# EasyEDA schematic tcc-esquemaico-aplicacoes.json

## Sheets
1 balanca-tcc: TITLE: Sheet_2; REV: 1.0; Date: 2021-08-01; Sheet: 1/1; Drawn By: victor-98; Company: Your Company
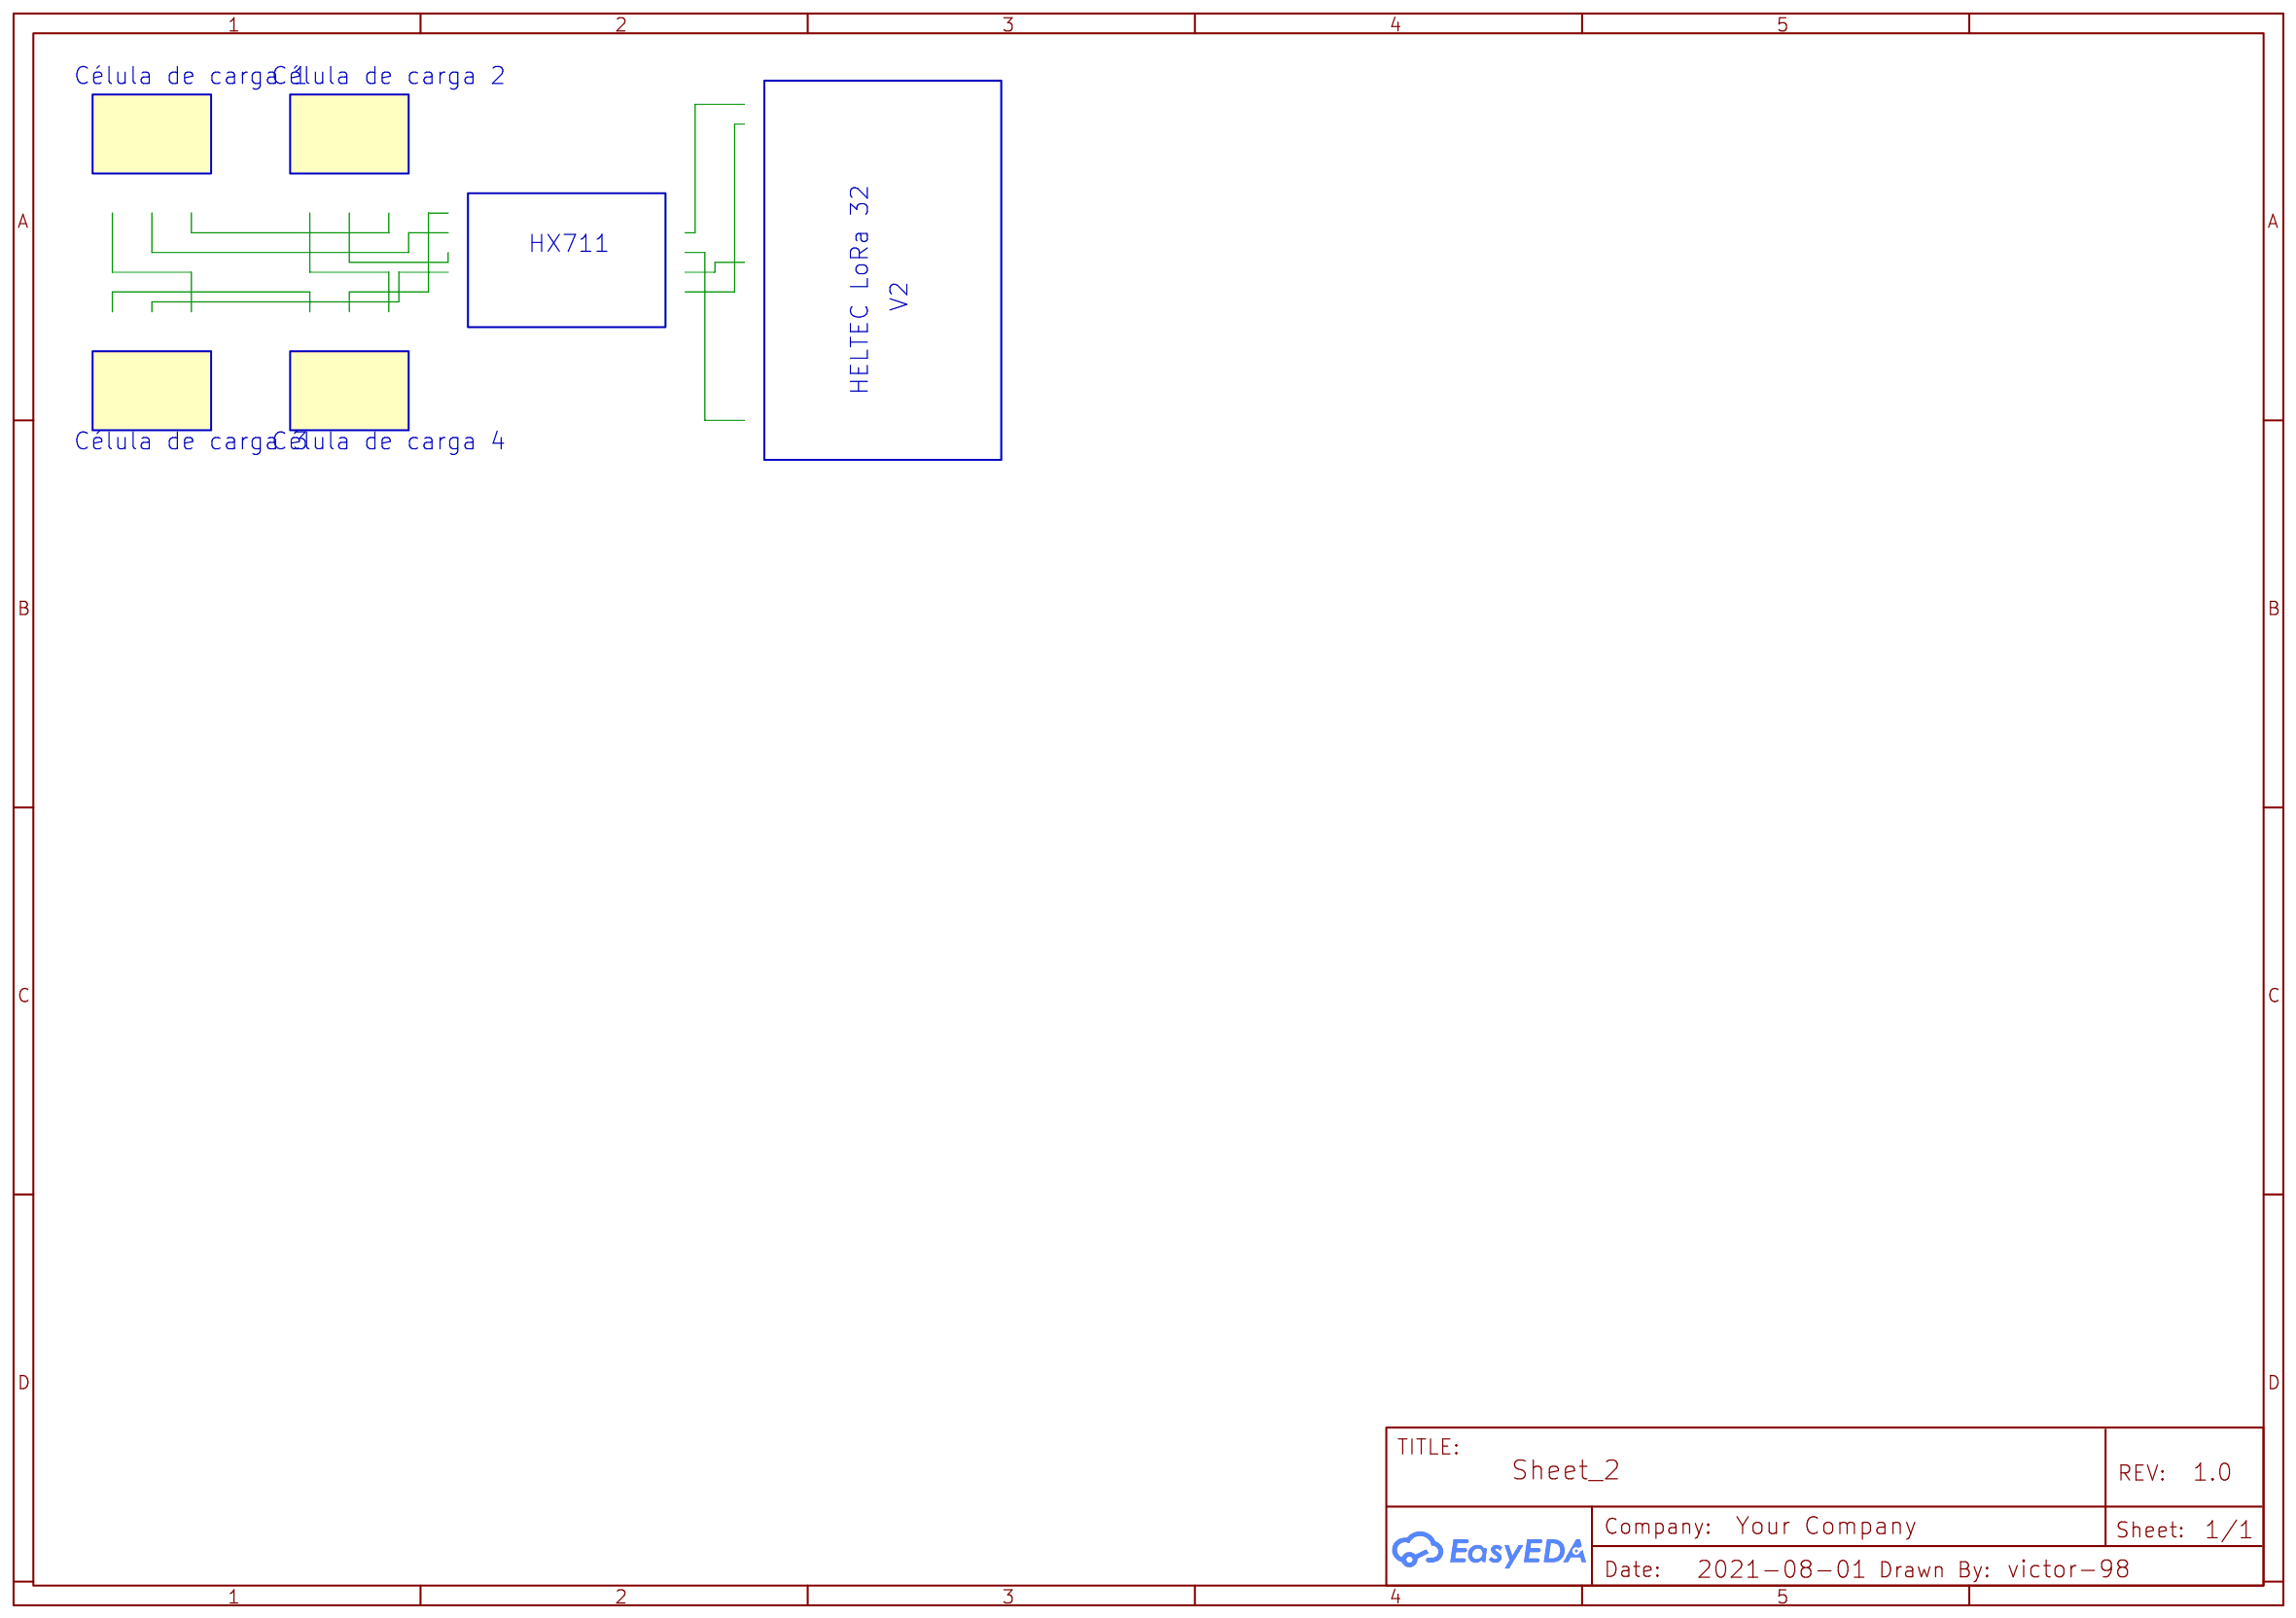
[diagram p0: balanca-tcc]
2 nivel-agua-tcc: TITLE: Sheet_1
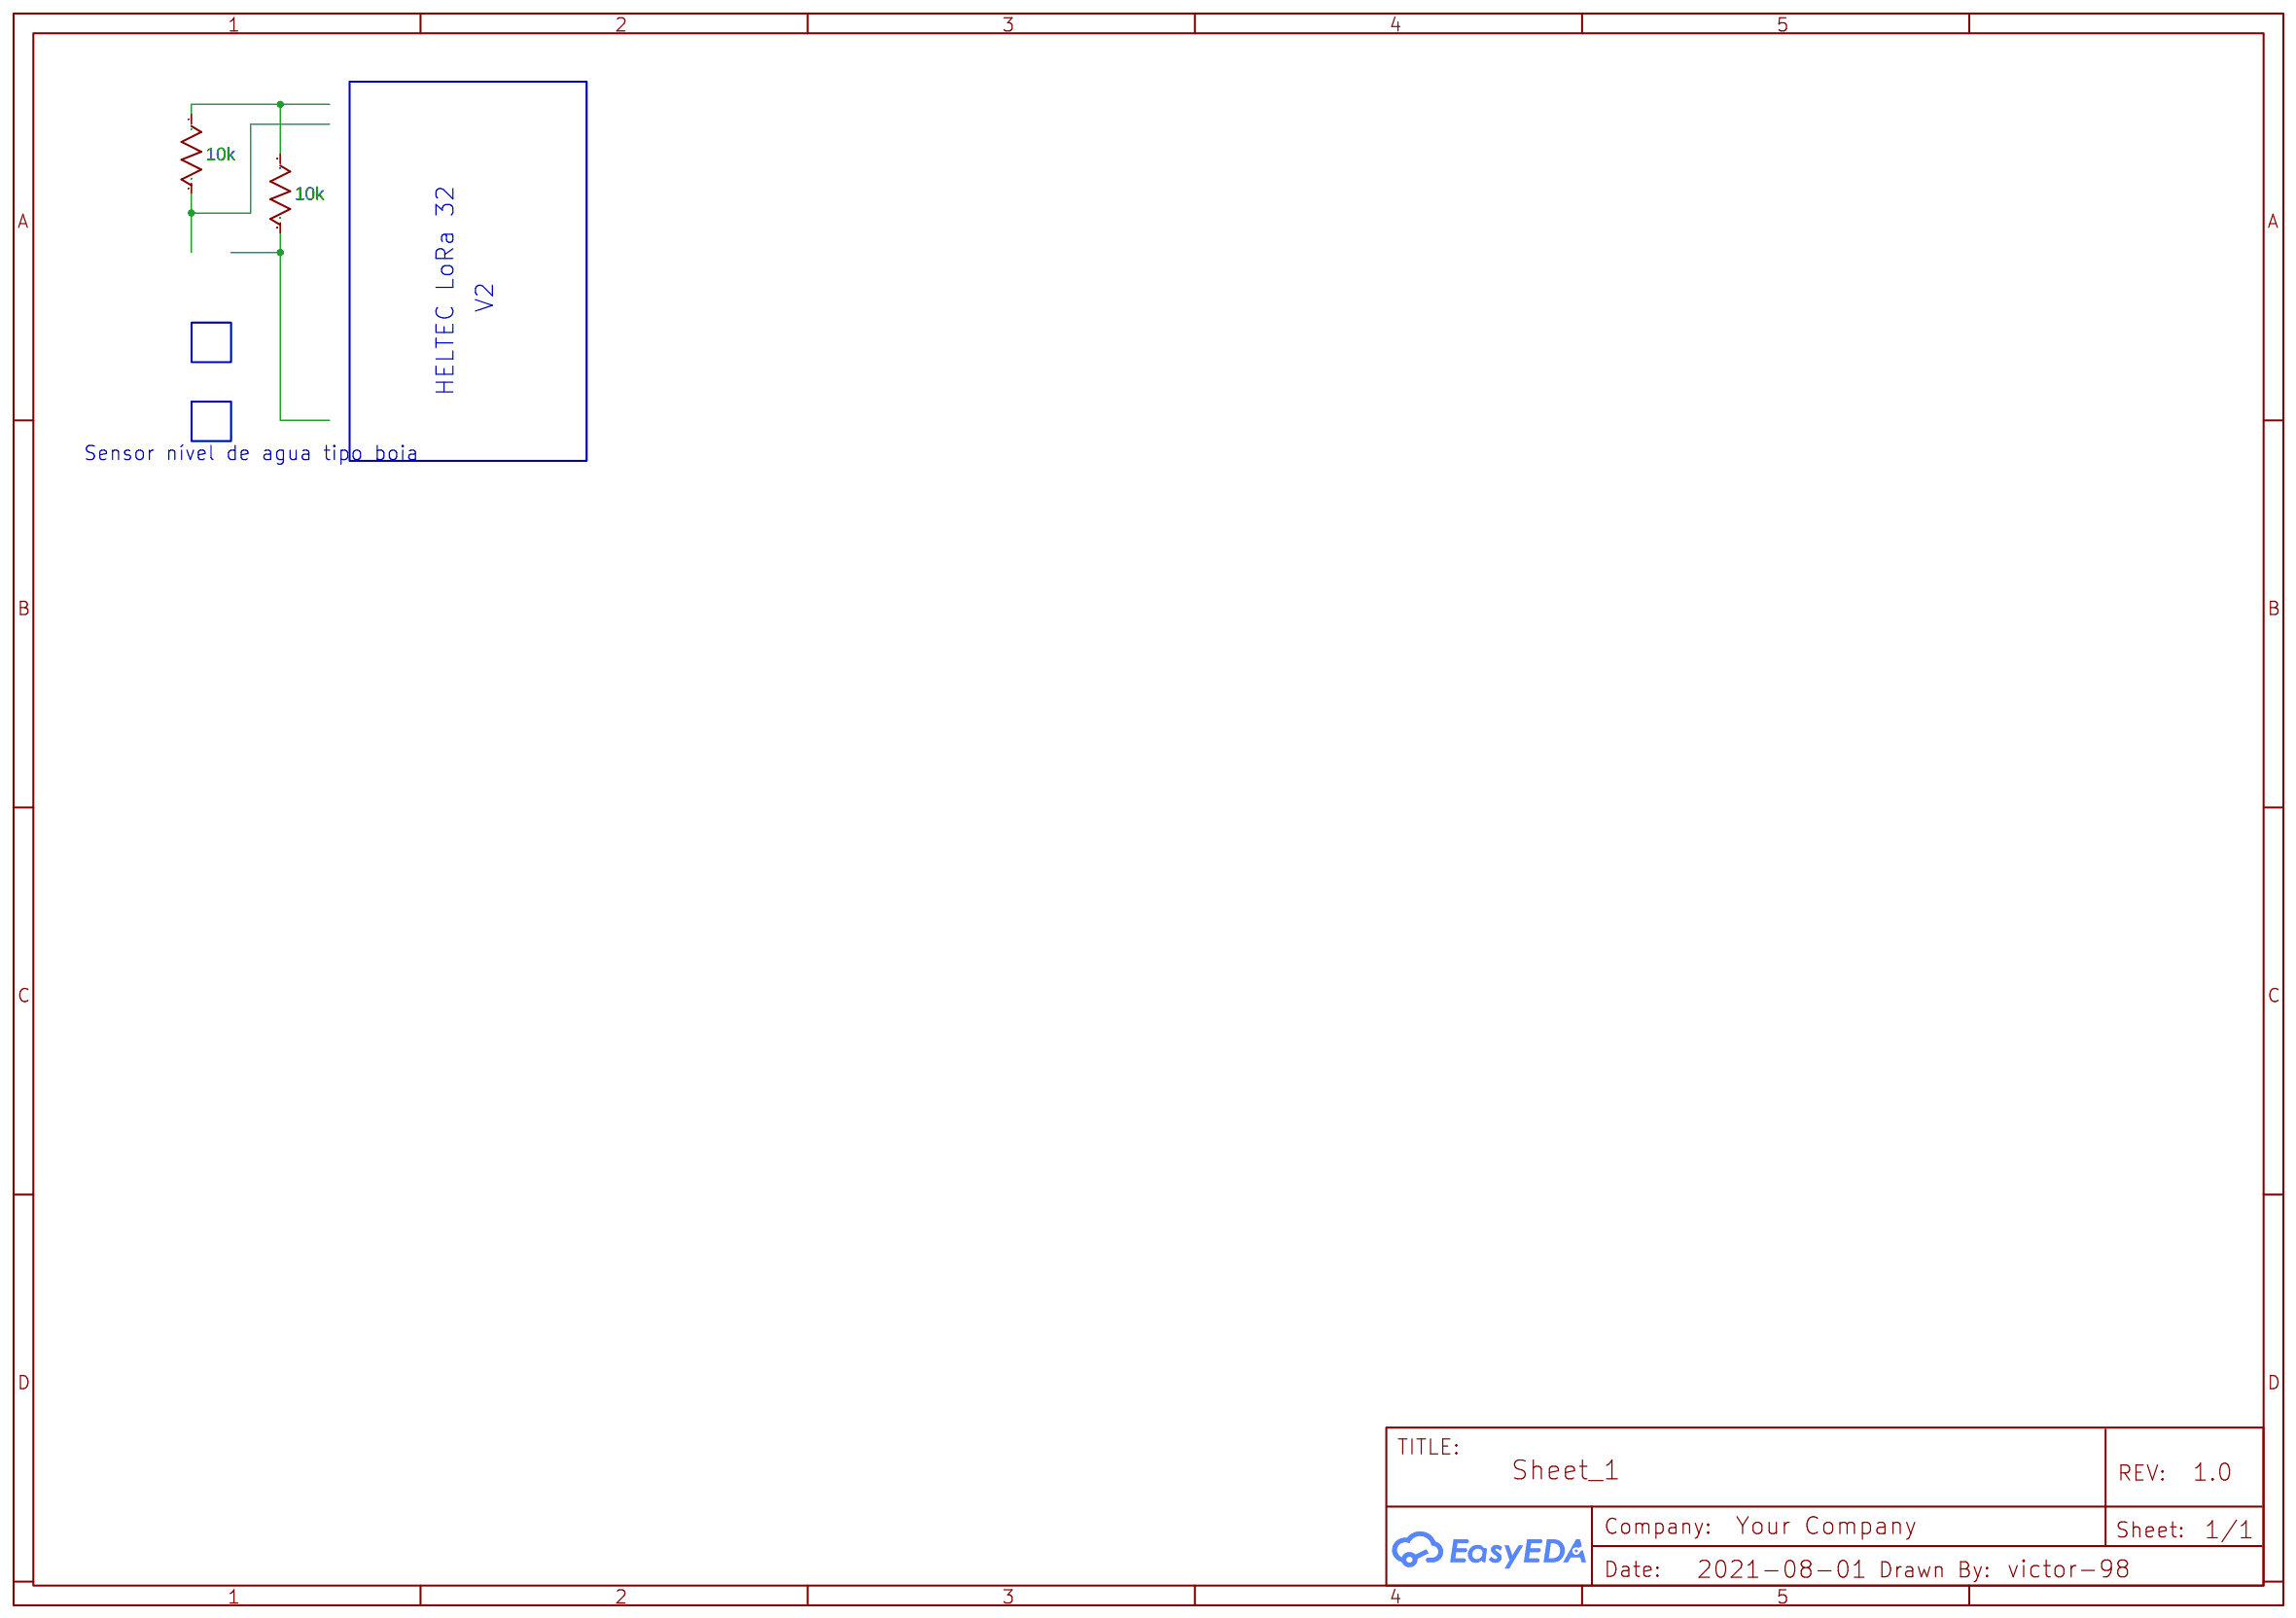
[diagram p1: nivel-agua-tcc]

## Parts
R1  10k  [R0603]
R2  10k  [R0603]

## Library data of the parts
R1 R2 = R_0603_US: Contributor: LCEDA_Lib

## Nets
Net-(R1-1): R1.1 R2.1

Not connected (* = marked no-connect by the designer): R1 2; R2 2

## Notes on the sheets
sheet 1
- Célula de carga 1
- Célula de carga 2
- HX711
- V2
- HELTEC LoRa 32
- Célula de carga 3
- Célula de carga 4
sheet 2
- V2
- HELTEC LoRa 32
- Sensor nível de agua tipo boia
